# Altium project sensors.PrjPcb
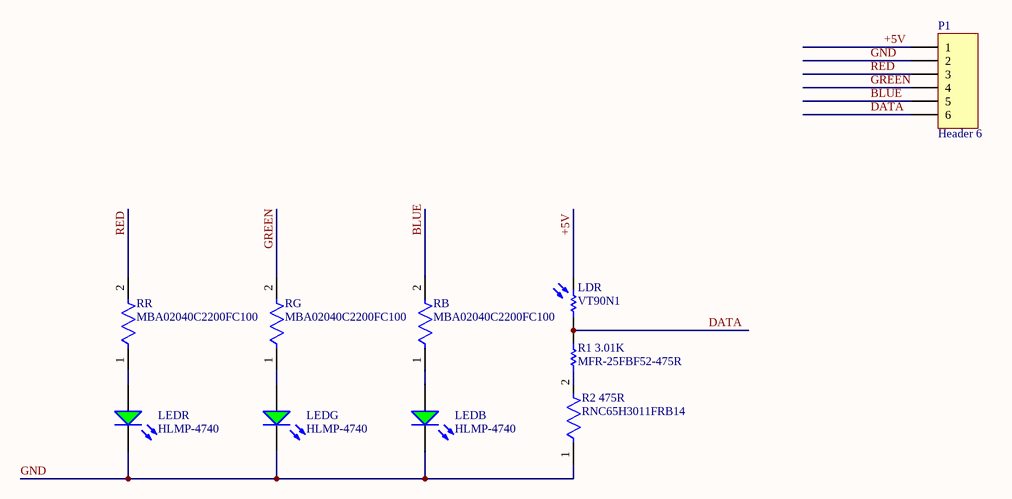
[diagram p0: sensors_sch.SchDoc]
1 sheet, 10 parts. Net scope: global (net labels, ports and power ports of the same name join across sheets).
Board file: sensors_pcb.PcbDoc

## Sheet sensors_sch.SchDoc
size A

### Parts
LDR  VT90N1  [EXCE-VT90N1]
LEDB  HLMP-4740  [AVAG-HLMP-4740]
LEDG  HLMP-4740  [AVAG-HLMP-4740]
LEDR  HLMP-4740  [AVAG-HLMP-4740]
P1  Header 6  [HDR1X6]
R1_3.01K  MFR-25FBF52-475R  [RESA60-630X240]
R2_475R  RNC65H3011FRB14  [FP-RNC65-MFG]
RB  MBA02040C2200FC100  [FP-MBA0204-MFG]
RG  MBA02040C2200FC100  [FP-MBA0204-MFG]
RR  MBA02040C2200FC100  [FP-MBA0204-MFG]

### Nets
+5V: LDR.2 P1.1
BLUE: P1.5 RB.2
DATA: LDR.1 P1.6 R1_3.01K.2
GND: LEDB.2(K) LEDG.2(K) LEDR.2(K) P1.2 R2_475R.1
GREEN: P1.4 RG.2
RED: P1.3 RR.2
NetLEDB_1: LEDB.1(A) RB.1
NetLEDG_1: LEDG.1(A) RG.1
NetLEDR_1: LEDR.1(A) RR.1
NetR1_3.01K_1: R1_3.01K.1 R2_475R.2

### Library data of the parts
LDR = CMP-2000-07406-1: Photoconductive Resistor, 200 kOhm, 100 V, 80 mW, -40 to 75 degC, 2-Pin THD, RoHS; Manufacturer: Excelitas Technology; SVHC: Cadmiumchloride(15-Jun-2015); Power Rating: 80mW; Resistance @ Lux: 12kohm; Voltage Rating: 100V; Product Range: -; Datasheet Version: 09/2006; Resistor Case Style: -; Operating Temperature Max: 75°C; Package Reference: VT90N1; Datasheet URL: http://datasheet.octopart.com/VT90N1-Excelitas-datasheet-10388451.pdf; Mounting Technology: ThroughHole; Operating Temperature Min: -40°C; Dark Resistance: 200kohm; Package Description: 2-Pin Through Hole Device, Body Width 4.17 mm (Max), Height 2.29 mm; Manufacturer URL: http://www.excelitas.com/Pages/Index.aspx; Packaging: Each
LEDB LEDG LEDR = CMP-2000-06413-1: T-1 3/4 (5 mm) Low Current LED Lamp, Green, 1.9 V, -20 to 100 degC, 2-Pin THD, RoHS, Bulk; Manufacturer: AvagoTechnologies; Peak Wavelength: 565nm; Rad Hard: No; Viewing Angle: 50°; Dominant Wavelength/Color Temperature: 569nm; Number of LEDs: 1; Lens Appearance: ColoredDiffused; Lens Shape Type: Circular; Mounting Orientation: TopMount; Intensity: 2.3mcd; Datasheet Version: 07/2014; Category: LEDs; Datasheet URL: http://docs.avagotech.com/docs/AV02-1557EN; Packaging: Bulk; Pin Count: 2; Mounting Technology: ThroughHole; Package Reference: HLMP-4740; Mounting: ThroughHole; Type: Uni-Color; Manufacturer URL: http://www.avagotech.com/; Color: Green; Package: 2T-13/4; Package Description: 2-Pin Through Hole Device, Dia 5.845 mm, Pitch 2.54 mm
P1 = Header 6: Header, 6-Pin; LatestRevisionDate: 17-Jul-2002; LatestRevisionNote: Re-released for DXP Platform.; Publisher: Altium Limited
R1_3.01K = CMP-1659-00068-1: Axial Resistor, 475 Ohm, +/- 1%, 0.25 W, -55 to 155 degC, 2-Pin THD, RoHS, Bulk; RAM Size: 64 KB; I\Os: 70; Density: 512 KB; Min Supply Voltage: 2.4 V; UART Channels: 4; Ethernet Channels: 1; PWM Channels: 7; Max Clock Frequency: 100 MHz; Max Power Dissipation: 1.5 W; Case\Package: LQFP; Interface: UART; Nominal Supply Voltage: 3.3 V; ADC Channels: 8; Max Supply Voltage: 3.6 V; Width: 14.1 mm; DatasheetVersion: Apr-13; Packaging: Tray; Length: 14.1 mm; ComponentLink2Description: Datasheet; ComponentLink1URL: http://www.yageo.com/; Pins: 100; PackageReference: MFR-25; Min Operating Temperature: -40 degC; ComponentLink1Description: Manufacturer URL; Max Operating Temperature: 85 degC; PackageDescription: 2-Pin Axial Lead, Dia 2.4 mm, Body Length 6.3 mm; Height: 1.45 mm; Radiation Hardening: No; RoHSCompliant: true; Package Quantity: 90; Frequency: 100 MHz; REACH SVHC: No SVHC; ComponentLink2URL: http://www.yageo.com/documents/recent/Yageo%20LR_MFR_2013.pdf; Mount: Surface Mount
R2_475R = CMP-02408-000008-1: Res Metal Film 3.01K Ohm 1% 0.5W(1/2W) ±50ppm/C 0.01% Epoxy AXL T/R; Manufacturer: Vishay; Resistance: 3.01kΩ; Voltage Rating: 300V; Value: 3.01kΩ; Temperature Coefficient: 50ppm/°C; Device Class L3: Through-Hole Resistors; Temperature Range High: +175°C; Manufacturer Part Number: RNC65H3011FRB14; Tolerance: 1%; Military Standard: true; Device Class L2: Resistors; Temperature: -65°C to +175°C; Lead Free: Yes; Category: Res; RoHS: TRUE; Series: RNC; Temperature Range Low: -65°C; Package: RNC65; Octopart: https://octopart.com/rnc65h3011frb14-vishay-40281131; ComponentLink2Description: Datasheet; Composition: Metal Film; Device Class L1: Passive Components; Height: 4.95mm; Ipc Land Pattern Name: RESAD2083W85L1745D495; Automotive: No; ComponentLink2URL: https://www.vishay.com/docs/31025/erc.pdf; Power Rating: 0.5W
RB RG RR = CMP-02408-000005-1: RES 220 OHM 0.4W 1% AXIAL; Manufacturer: Vishay BC Components; Automotive Grade: Grade 1; Value: 220Ω; Voltage Rating: 200V; Temperature Coefficient: 50ppm/°C; Description: 220 Ohms ±1% 0.4W Through Hole Resistor Axial Automotive AEC-Q200 Metal Film; Power Rating: 0.25W; Digikey Description: RES 220 OHM 0.4W 1% AXIAL; Height: 1.6mm; Automotive: Yes; Lead Free: Yes; Mouser Description: Thin Film Resistors - Through Hole .4watt 220ohms 1% 1/8watt body size; Temperature Range Low: -55°C; ComponentLink2Description: Datasheet; Temperature: -55°C to +125°C; Device Class L3: Through-Hole Resistors; Manufacturer Part Number: MBA02040C2200FC100; Ipc Land Pattern Name: RESAD500W65L360D160; Octopart: https://octopart.com/mba02040c2200fc100-vishay-43743094; Series: MBA/SMA 0204; RoHS: TRUE; Tolerance: 1%; Package: MBA0204; Device Class L1: Passive Components; ComponentLink2URL: http://www.vishay.com/docs/28766/mbxsma.pdf; Category: Res; Composition: Metal Film; Device Class L2: Resistors; Temperature Range High: +125°C; Resistance: 220Ω